# EasyEDA Pro project ProPrj_ch32v305_pico.epro, board 40low_CH32V305_8K
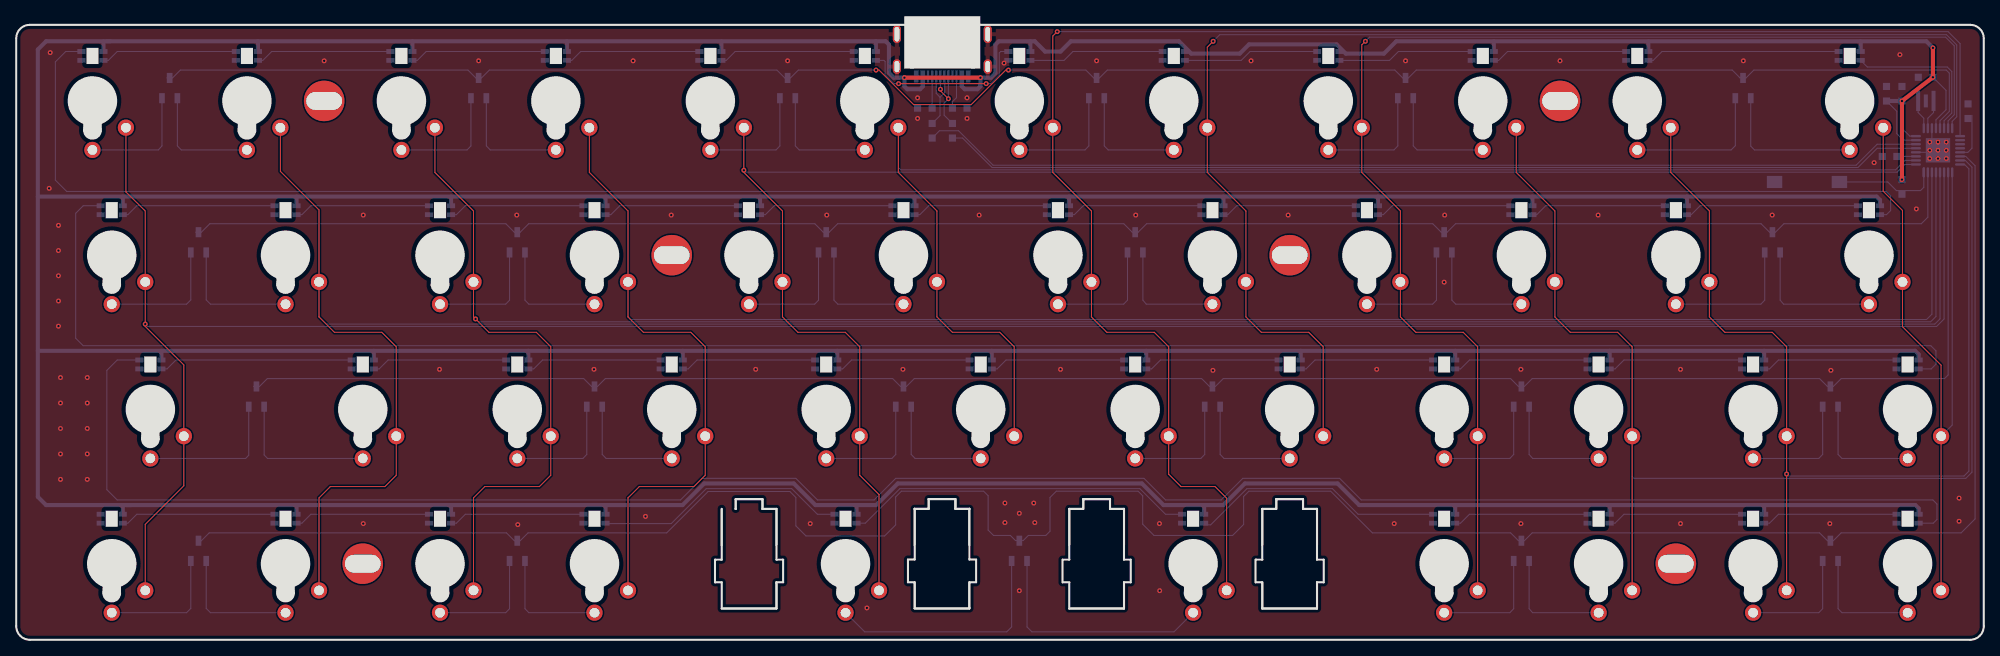
[diagram p9: board, top side]
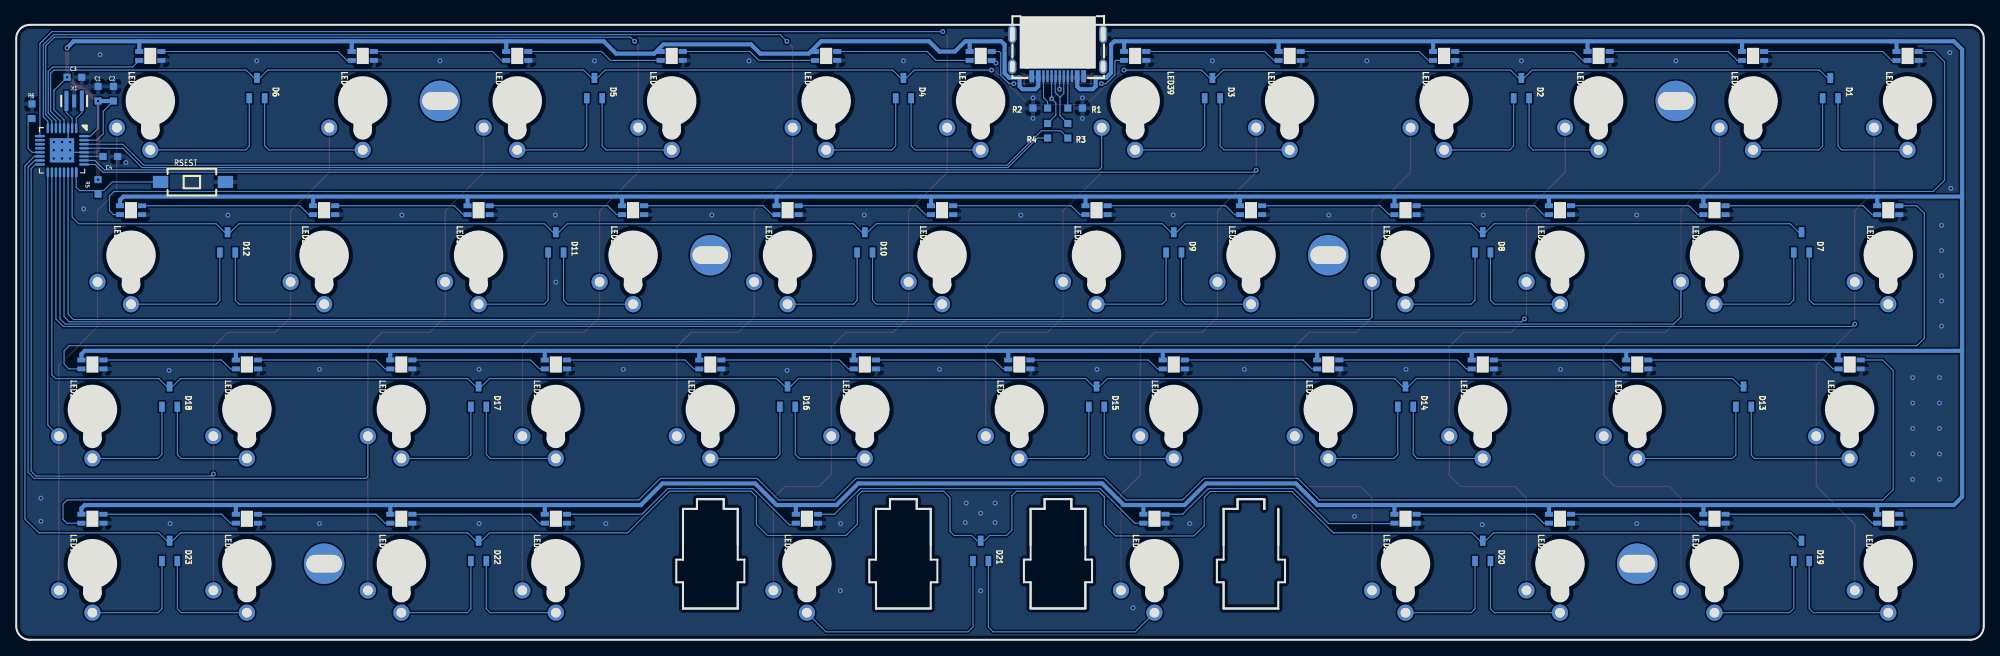
[diagram p10: board, bottom side, seen from below]

Outline 242.63 x 77.01 mm; copper layers: Top Layer, Bottom Layer. Coordinates in mm from the lower left corner of the outline.
Outline path: 86.99,11.7 86.99,16.17 86.99,9.9 86.17,9.9 86.17,7.1 86.99,7.1 86.99,3.87 ; 86.99,3.87 93.74,3.87 ; 86.99,3.87 93.74,3.87 ; 93.74,3.87 93.74,7.1 ; 93.74,3.87 93.74,7.1 ; 88.72,17.37 88.72,16.17 88.72,17.37 ; 88.72,17.37 92.02,17.37 92.02,16.17 93.74,16.17 ; 88.72,17.37 92.02,17.37 92.02,16.17 93.74,16.17 ; 93.74,16.17 93.74,11.7 ; 93.74,16.17 93.74,9.9 94.57,9.9 94.57,7.1 93.74,7.1 ; 110.79,7.11 109.96,7.11 109.96,9.91 110.79,9.91 110.79,16.18 ; 110.79,7.11 110.79,3.88 ; 110.79,7.11 110.79,3.88 ; 110.79,16.18 110.79,11.71 ; 110.79,16.18 112.51,16.18 ; 110.79,16.18 112.52,16.18 ; 110.79,3.88 117.54,3.88 ; 110.79,3.88 117.54,3.88 ; 117.54,3.88 117.54,7.11 ; 117.54,3.88 117.54,7.11 ; 112.51,17.38 112.51,16.18 ; 112.52,17.38 112.52,16.18 ; 112.51,17.38 115.81,17.38 115.81,16.18 117.54,16.18 ; 112.52,17.38 115.81,17.38 115.81,16.18 117.54,16.18 ; 117.54,16.18 117.54,11.71 ; 117.54,16.18 117.54,9.91 118.37,9.91 118.37,7.11 117.54,7.11 ; 129.86,16.17 129.86,11.7 ; 129.86,16.17 129.86,9.9 129.03,9.9 129.03,7.1 129.86,7.1 129.86,3.87 ; 129.86,16.17 131.58,16.17 131.58,17.37 134.88,17.37 134.88,16.17 136.61,16.17 136.61,11.7 ; 129.86,16.17 131.58,16.17 131.58,17.37 134.88,17.37 134.88,16.17 136.61,16.17 136.61,9.9 137.43,9.9 137.43,7.1 136.61,7.1 136.61,3.87 129.86,3.87 ; 129.86,3.87 136.61,3.87 136.61,7.1 ; 153.66,11.7 153.66,16.17 155.38,16.17 155.38,17.37 158.68,17.37 158.68,16.17 160.41,16.17 160.41,9.9 161.23,9.9 161.23,7.1 160.41,7.1 160.41,3.87 153.66,3.87 153.66,7.1 152.83,7.1 152.83,9.9 153.66,9.9 153.66,16.17 155.38,16.17 155.38,17.37 158.68,17.37 158.68,16.17 160.41,16.17 160.41,11.7 ; 153.66,7.1 153.66,3.87 160.41,3.87 160.41,7.1 ; 0,74.27 arc(0.49,75.46) 1.68,75.95 240.95,75.95 arc(242.14,75.46) 242.63,74.27 242.63,1.68 arc(242.14,0.49) 240.95,0 1.68,0 arc(0.49,0.49) 0,1.68 0,74.27
Stack: Top Layer 0.035mm / Bottom Layer 0.035mm

## Design rules (mm)
spacing Default (default): track to track 0.102, other pairs 0 to 0.3
track width Default (default): min 0.127, default 0.127, max 25.4
differential pair differentialPair (default): width min 0.127, default 2.54, max 2.54; gap min 0.127, default 0.152

## Placement (name value [footprint] x y rotation side)
C1  100nf  [0603]  232.54 67.44 90 bottom
C2  100nf  [0603]  230.63 67.44 90 bottom
C3  470nf  [0603]  235.46 69.47 180 bottom
C4  1uf  [0603]  231.01 59.69 0 bottom
D1  MMBD4148  [SOT-23-3]  18.92 68.14 270 bottom
D2  MMBD4148  [SOT-23-3]  57.02 68.14 270 bottom
D3  MMBD4148  [SOT-23-3]  95.12 68.14 270 bottom
D4  MMBD4148  [SOT-23-3]  133.22 68.14 270 bottom
D5  MMBD4148  [SOT-23-3]  171.32 68.14 270 bottom
D6  MMBD4148  [SOT-23-3]  212.94 68.14 270 bottom
D7  MMBD4148  [SOT-23-3]  22.48 49.09 270 bottom
D8  MMBD4148  [SOT-23-3]  61.79 49.09 270 bottom
D9  MMBD4148  [SOT-23-3]  99.89 49.09 270 bottom
D10  MMBD4148  [SOT-23-3]  137.99 49.09 270 bottom
D11  MMBD4148  [SOT-23-3]  176.09 49.09 270 bottom
D12  MMBD4148  [SOT-23-3]  216.57 49.09 270 bottom
D13  MMBD4148  [SOT-23-3]  29.62 30.04 270 bottom
D14  MMBD4148  [SOT-23-3]  71.31 30.04 270 bottom
D15  MMBD4148  [SOT-23-3]  109.41 30.04 270 bottom
D16  MMBD4148  [SOT-23-3]  147.51 30.04 270 bottom
D17  MMBD4148  [SOT-23-3]  185.61 30.04 270 bottom
D18  MMBD4148  [SOT-23-3]  223.71 30.04 270 bottom
D19  MMBD4148  [SOT-23-3]  22.48 10.99 270 bottom
D20  MMBD4148  [SOT-23-3]  61.79 10.99 270 bottom
D21  MMBD4148  [SOT-23-3]  123.7 10.99 270 bottom
D22  MMBD4148  [SOT-23-3]  185.61 10.99 270 bottom
D23  MMBD4148  [SOT-23-3]  223.71 10.99 270 bottom
LED0  WS2812B  [WS2812 0807]  11.78 14.95 0 bottom
LED1  WS2812B  [WS2812 0807]  33.21 14.95 0 bottom
LED2  WS2812B  [WS2812 0807]  52.26 14.95 0 bottom
LED3  WS2812B  [WS2812 0807]  71.31 14.95 0 bottom
LED4  WS2812B  [WS2812 0807]  102.27 14.95 0 bottom
LED5  WS2812B  [WS2812 0807]  145.13 14.95 0 bottom
LED6  WS2812B  [WS2812 0807]  176.09 14.95 0 bottom
LED7  WS2812B  [WS2812 0807]  195.14 14.95 0 bottom
LED8  WS2812B  [WS2812 0807]  214.19 14.95 0 bottom
LED9  WS2812B  [WS2812 0807]  233.24 14.95 0 bottom
LED10  WS2812B  [WS2812 0807]  16.54 34 0 bottom
LED11  WS2812B  [WS2812 0807]  42.74 34 0 bottom
LED12  WS2812B  [WS2812 0807]  61.79 34 0 bottom
LED13  WS2812B  [WS2812 0807]  80.84 34 0 bottom
LED14  WS2812B  [WS2812 0807]  99.89 34 0 bottom
LED15  WS2812B  [WS2812 0807]  118.94 34 0 bottom
LED16  WS2812B  [WS2812 0807]  137.99 34 0 bottom
LED17  WS2812B  [WS2812 0807]  157.04 34 0 bottom
LED18  WS2812B  [WS2812 0807]  176.09 34 0 bottom
LED19  WS2812B  [WS2812 0807]  195.14 34 0 bottom
LED20  WS2812B  [WS2812 0807]  214.19 34 0 bottom
LED21  WS2812B  [WS2812 0807]  233.24 34 0 bottom
LED22  WS2812B  [WS2812 0807]  11.78 53.05 0 bottom
LED23  WS2812B  [WS2812 0807]  33.21 53.05 0 bottom
LED24  WS2812B  [WS2812 0807]  52.26 53.05 0 bottom
LED25  WS2812B  [WS2812 0807]  71.31 53.05 0 bottom
LED26  WS2812B  [WS2812 0807]  90.36 53.05 0 bottom
LED27  WS2812B  [WS2812 0807]  109.41 53.05 0 bottom
LED28  WS2812B  [WS2812 0807]  128.46 53.05 0 bottom
LED29  WS2812B  [WS2812 0807]  147.51 53.05 0 bottom
LED30  WS2812B  [WS2812 0807]  166.56 53.05 0 bottom
LED31  WS2812B  [WS2812 0807]  185.61 53.05 0 bottom
LED32  WS2812B  [WS2812 0807]  204.66 53.05 0 bottom
LED33  WS2812B  [WS2812 0807]  228.47 53.05 0 bottom
LED34  WS2812B  [WS2812 0807]  9.4 72.1 0 bottom
LED35  WS2812B  [WS2812 0807]  28.45 72.1 0 bottom
LED36  WS2812B  [WS2812 0807]  47.5 72.1 0 bottom
LED37  WS2812B  [WS2812 0807]  66.55 72.1 0 bottom
LED38  WS2812B  [WS2812 0807]  85.6 72.1 0 bottom
LED39  WS2812B  [WS2812 0807]  104.65 72.1 0 bottom
LED40  WS2812B  [WS2812 0807]  123.7 72.1 0 bottom
LED41  WS2812B  [WS2812 0807]  142.75 72.1 0 bottom
LED42  WS2812B  [WS2812 0807]  161.8 72.1 0 bottom
LED43  WS2812B  [WS2812 0807]  180.85 72.1 0 bottom
LED44  WS2812B  [WS2812 0807]  199.9 72.1 0 bottom
LED45  WS2812B  [WS2812 0807]  226.09 72.1 0 bottom
NOREF  -  [Pad_e676]  235.23 57.73 180 top
NOREF#2  -  [Pad_e1541]  157.04 47.5 0 top
NOREF#3  -  [Pad_e1542]  190.37 66.55 0 top
NOREF#4  -  [Pad_e1539]  204.66 9.4 0 top
NOREF#5  -  [Pad_e1540]  37.97 66.55 0 top
NOREF#6  -  [Pad_e1537]  42.74 9.4 0 top
NOREF#7  -  [Pad_e1538]  80.84 47.5 0 top
R1  5.1k  [0603]  112.05 65.66 0 bottom
R2  5.1k  [0603]  116.35 65.66 180 bottom
R3  22  [0603]  112.95 62.87 270 bottom
R4  22  [0603]  115.45 62.87 270 bottom
R5  10k  [0603]  232.54 55.93 90 bottom
R6  10k  [0603]  240.69 65.28 90 bottom
RSEST  TS-1101-C-W  [SW-SMD_L6.0-W3.3-LS8.0]  220.83 56.54 180 bottom
S1  MX COPY  [CHERRY-MX-LOW-PROFILE COPY]  9.4 66.55 0 top
S2  MX COPY  [CHERRY-MX-LOW-PROFILE COPY]  28.45 66.55 0 top
S3  MX COPY  [CHERRY-MX-LOW-PROFILE COPY]  47.5 66.55 0 top
S4  MX COPY  [CHERRY-MX-LOW-PROFILE COPY]  66.55 66.55 0 top
S5  MX COPY  [CHERRY-MX-LOW-PROFILE COPY]  85.6 66.55 0 top
S6  MX COPY  [CHERRY-MX-LOW-PROFILE COPY]  104.65 66.55 0 top
S7  MX COPY  [CHERRY-MX-LOW-PROFILE COPY]  123.7 66.55 0 top
S8  MX COPY  [CHERRY-MX-LOW-PROFILE COPY]  142.75 66.55 0 top
S9  MX COPY  [CHERRY-MX-LOW-PROFILE COPY]  161.8 66.55 0 top
S10  MX COPY  [CHERRY-MX-LOW-PROFILE COPY]  180.85 66.55 0 top
S11  MX COPY  [CHERRY-MX-LOW-PROFILE COPY]  199.9 66.55 0 top
S12  MX COPY  [CHERRY-MX-LOW-PROFILE COPY]  226.09 66.55 0 top
S13  MX COPY  [CHERRY-MX-LOW-PROFILE COPY]  11.78 47.5 0 top
S14  MX COPY  [CHERRY-MX-LOW-PROFILE COPY]  33.21 47.5 0 top
S15  MX COPY  [CHERRY-MX-LOW-PROFILE COPY]  52.26 47.5 0 top
S16  MX COPY  [CHERRY-MX-LOW-PROFILE COPY]  71.31 47.5 0 top
S17  MX COPY  [CHERRY-MX-LOW-PROFILE COPY]  90.36 47.5 0 top
S18  MX COPY  [CHERRY-MX-LOW-PROFILE COPY]  109.41 47.5 0 top
S19  MX COPY  [CHERRY-MX-LOW-PROFILE COPY]  128.46 47.5 0 top
S20  MX COPY  [CHERRY-MX-LOW-PROFILE COPY]  147.51 47.5 0 top
S21  MX COPY  [CHERRY-MX-LOW-PROFILE COPY]  166.56 47.5 0 top
S22  MX COPY  [CHERRY-MX-LOW-PROFILE COPY]  185.61 47.5 0 top
S23  MX COPY  [CHERRY-MX-LOW-PROFILE COPY]  204.66 47.5 0 top
S24  MX COPY  [CHERRY-MX-LOW-PROFILE COPY]  228.47 47.5 0 top
S25  MX COPY  [CHERRY-MX-LOW-PROFILE COPY]  16.54 28.45 0 top
S26  MX COPY  [CHERRY-MX-LOW-PROFILE COPY]  42.74 28.45 0 top
S27  MX COPY  [CHERRY-MX-LOW-PROFILE COPY]  61.79 28.45 0 top
S28  MX COPY  [CHERRY-MX-LOW-PROFILE COPY]  80.84 28.45 0 top
S29  MX COPY  [CHERRY-MX-LOW-PROFILE COPY]  99.89 28.45 0 top
S30  MX COPY  [CHERRY-MX-LOW-PROFILE COPY]  118.94 28.45 0 top
S31  MX COPY  [CHERRY-MX-LOW-PROFILE COPY]  137.99 28.45 0 top
S32  MX COPY  [CHERRY-MX-LOW-PROFILE COPY]  157.04 28.45 0 top
S33  MX COPY  [CHERRY-MX-LOW-PROFILE COPY]  176.09 28.45 0 top
S34  MX COPY  [CHERRY-MX-LOW-PROFILE COPY]  195.14 28.45 0 top
S35  MX COPY  [CHERRY-MX-LOW-PROFILE COPY]  214.19 28.45 0 top
S36  MX COPY  [CHERRY-MX-LOW-PROFILE COPY]  233.24 28.45 0 top
S37  MX COPY  [CHERRY-MX-LOW-PROFILE COPY]  11.78 9.4 0 top
S38  MX COPY  [CHERRY-MX-LOW-PROFILE COPY]  33.21 9.4 0 top
S39  MX COPY  [CHERRY-MX-LOW-PROFILE COPY]  52.26 9.4 0 top
S40  MX COPY  [CHERRY-MX-LOW-PROFILE COPY]  71.31 9.4 0 top
S41  MX COPY  [CHERRY-MX-LOW-PROFILE COPY]  102.27 9.4 0 top
S42  MX COPY  [CHERRY-MX-LOW-PROFILE COPY]  145.13 9.4 0 top
S43  MX COPY  [CHERRY-MX-LOW-PROFILE COPY]  176.09 9.4 0 top
S44  MX COPY  [CHERRY-MX-LOW-PROFILE COPY]  195.14 9.4 0 top
S45  MX COPY  [CHERRY-MX-LOW-PROFILE COPY]  214.19 9.4 0 top
S46  MX COPY  [CHERRY-MX-LOW-PROFILE COPY]  233.24 9.4 0 top
U2  ATMEGA32U2-MU  [32U2-MU]  236.98 60.45 0 bottom
USB1  TYPE-C 16P CB1.6  [USB-C-SMD_TYPE-C-16P-CB1.6]  114.2 72.19 0 bottom
X1  16MHz  [OSC-SMD_3P-L3.2-W1.3-P0.95-L]  235.48 66.55 0 bottom

## Footprints (pads in the part's own frame, mm; a bottom-side part is the same pattern mirrored in y, then rotated)
32U2-MU
  oval 0.3x1.25 smd: 1(-1.75,-2.725) 2(-1.252,-2.725) 3(-0.751,-2.725) 4(-0.252,-2.725) 5(0.248,-2.725) 6(0.749,-2.725) 7(1.248,-2.725) 8(1.748,-2.725) 17(1.752,2.725) 18(1.252,2.725) 19(0.751,2.725) 20(0.252,2.725) 21(-0.248,2.725) 22(-0.749,2.725) 23(-1.248,2.725) 24(-1.748,2.725)
  oval 1.25x0.3 smd: 9(2.725,-1.748) 10(2.725,-1.248) 11(2.725,-0.748) 12(2.725,-0.248) 13(2.725,0.252) 14(2.725,0.752) 15(2.725,1.252) 16(2.725,1.752) 25(-2.725,1.75) 26(-2.725,1.25) 27(-2.725,0.75) 28(-2.725,0.25) 29(-2.725,-0.25) 30(-2.725,-0.75) 31(-2.725,-1.25) 32(-2.725,-1.75)
  rect 3x3 smd: 33(0,0)
0603
  rect 0.88x0.88 smd: 1(-0.9,0) 2(0.9,0)
CHERRY-MX-LOW-PROFILE COPY
  round 2 hole 1.205x1.2: 1(4.13,-3.3) 2(0,-6.05)
OSC-SMD_3P-L3.2-W1.3-P0.95-L
  rect 0.5x2.5 smd: 1(-0.95,0) 3(0.95,0)
  rect 0.5x1.6 smd: 2(0,0)
Pad_e676
  oval 0.3x1.25 smd far side: 2(0,0)
Pad_e1537
  round 5 hole 4.4x2.2: 1(0,0)
Pad_e1538
  round 5 hole 4.4x2.2: 1(0,0)
Pad_e1539
  round 5 hole 4.4x2.2: 1(0,0)
Pad_e1540
  round 5 hole 4.4x2.2: 1(0,0)
Pad_e1541
  round 5 hole 4.4x2.2: 1(0,0)
Pad_e1542
  round 5 hole 4.4x2.2: 1(0,0)
SOT-23-3
  rect 1.25x0.7 smd: 1(1.25,-0.95) 2(1.25,0.95) 3(-1.25,0)
SW-SMD_L6.0-W3.3-LS8.0
  rect 1.9x1.5 smd: 1(-4,0) 2(4,0)
USB-C-SMD_TYPE-C-16P-CB1.6
  oval 1x1.8 hole 0.6x1.4: 13(5.6,1.4) 16(-5.6,1.4)
  oval 1x2.2 hole 0.6x1.8: 14(5.6,-2.6) 15(-5.6,-2.6)
  rect 0.6x1.5 smd: A1B12(-3.2,2.6) A4B9(-2.4,2.6) B1A12(3.2,2.6) B4A9(2.4,2.6)
  rect 0.3x1.5 smd: A5(-1.25,2.6) A6(-0.25,2.6) A7(0.25,2.6) A8(1.25,2.6) B5(1.75,2.6) B6(0.75,2.6) B7(-0.75,2.6) B8(-1.75,2.6)
WS2812 0807
  rect 1x0.6 smd: 1(1.36,-0.55) 2(-1.36,-0.55) 3(-1.36,0.55) 4(1.36,0.55)

## Nets
As in the schematic, except:
GND: C1.2 C2.2 C3.2 C4.1 LED0.3 LED1.3 LED2.3 LED3.3 LED4.3 LED5.3 LED6.3 LED7.3 LED8.3 LED9.3 LED10.3 LED11.3 LED12.3 LED13.3 LED14.3 LED15.3 LED16.3 LED17.3 LED18.3 LED19.3 LED20.3 LED21.3 LED22.3 LED23.3 LED24.3 LED25.3 LED26.3 LED27.3 LED28.3 LED29.3 LED30.3 LED31.3 LED32.3 LED33.3 LED34.3 LED35.3 LED36.3 LED37.3 LED38.3 LED39.3 LED40.3 LED41.3 LED42.3 LED43.3 LED44.3 LED45.3 R1.1 R2.1 R6.2 RSEST.2 U2.3 U2.28 U2.33 USB1.13 USB1.14 USB1.15 USB1.16 USB1.A1B12 USB1.B1A12 X1.2
U2_24: NOREF.2 R5.1 RSEST.1 U2.24

Pads without a net: LED0 2; NOREF#2 1; NOREF#3 1; NOREF#4 1; NOREF#5 1; NOREF#6 1; NOREF#7 1; U2 10 11 12; USB1 A8 B8

## Via types
v1: diameter 0.61, hole 0.305, Top Layer to Bottom Layer, 102 vias

## Routing (per net, layer and track width the routed paths; a pad name or vN(x,y) marks a point on that pad's centre or on a via; arc(x,y) is an arc through that point)
GND: length 5.9
  Bottom Layer w0.127: U2.3 236.23,61.2 v1(236.98,60.45) 236.73,60.2 234.26,60.2
  vias: v1(4.06,55.75) v1(4.19,72.52) v1(5.21,51.18) v1(5.21,48.07) v1(5.21,44.96) v1(5.21,41.85) v1(5.21,38.74) v1(5.46,32.39) v1(5.46,29.24) v1(5.46,26.1) v1(5.46,22.96) v1(5.46,19.81) v1(8.76,32.39) v1(8.76,29.24) v1(8.76,26.1) v1(8.76,22.96) v1(8.76,19.81) v1(37.97,71.5) v1(42.8,52.45) v1(42.8,14.35) v1(52.2,33.4) v1(57.02,71.5) v1(61.72,52.45) v1(61.85,14.22) v1(71.25,33.4) v1(76.07,71.5) v1(77.6,15.24) v1(80.77,52.45) v1(91.19,33.4) v1(95.12,71.5) v1(97.92,14.35) v1(99.95,52.45) v1(104.9,3.94) v1(109.35,33.4) v1(111.15,66.93) v1(111.15,64.39) v1(117.25,66.93) v1(117.25,64.39) v1(118.75,52.45) v1(121.82,71.22) v1(121.92,16.89) v1(121.92,14.48) v1(123.7,15.62) v1(123.7,6.06) v1(125.48,16.89) v1(125.6,14.48) v1(128.78,33.4) v1(133.22,71.5) v1(138.05,52.45) v1(140.97,14.35) v1(141,6.06) v1(147.57,33.27) v1(152.27,71.5) v1(156.84,52.45) v1(167.77,33.4) v1(169.93,14.35) v1(171.32,71.5) v1(176.15,52.45) v1(176.09,44.16) v1(185.55,33.4) v1(185.55,14.35) v1(190.37,71.5) v1(195.07,52.45) v1(205.23,33.4) v1(205.23,14.35) v1(212.98,71.5) v1(216.53,52.45) v1(223.65,14.35) v1(223.77,33.27) v1(229.11,58.93) v1(232.28,72.26) v1(234.32,53.21) v1(235.97,61.47) v1(235.97,60.45) v1(235.97,59.44) v1(236.98,61.47) v1(236.98,59.44) v1(238,61.47) v1(238,60.45) v1(238,59.44) v1(239.59,17.49) v1(239.59,14.64)
VCC: length 1099.7
  Top Layer w0.508: v1(118.9,69.42) v1(109.53,69.42) ; v1(232.54,56.83) v1(232.54,66.54) v1(236.36,69.47) v1(236.36,73.1)
  Bottom Layer w0.127: 230.63,66.54 231.9,65.27 231.9,62.51 232.71,61.7 234.26,61.7 ; U2.4 236.73,64.21 237.97,65.46 237.97,67.85 v1(236.36,69.47) ; v1(232.54,66.54) 232.54,63.17 233.51,62.2 234.26,62.2
  Bottom Layer w0.508: LED14.1 101.25,35.69 ; 2.67,54.74 229.41,54.74 229.83,54.32 229.83,53.6 ; LED45.1 227.45,73.91 ; LED5.1 146.49,16.64 ; C2.1 C1.1 ; LED13.1 82.2,35.69 ; 116.6,69.29 116.6,68.36 116.97,68 118.54,68 118.9,68.35 v1(118.9,69.42) 120.19,69.42 120.75,69.98 120.75,73.51 121.16,73.91 125.6,73.91 126.87,72.64 128.78,72.64 130.05,73.91 143.38,73.91 144.91,72.39 150.88,72.39 152.02,73.53 162.81,73.53 163.96,72.39 168.66,72.39 170.18,73.91 235.54,73.91 v1(236.36,73.1) ; LED4.1 103.63,16.64 ; 11.18,73.91 107.21,73.91 107.62,73.51 107.62,70 108.2,69.42 v1(109.53,69.42) 109.53,68.35 109.88,68 111.46,68 111.8,68.34 111.8,69.29 ; LED8.1 215.55,16.64 ; LED26.1 91.72,54.74 ; 14.2,16.64 3.68,16.64 2.67,17.65 2.67,72.9 3.68,73.91 11.58,73.91 ; LED0.1 13.14,16.64 ; LED9.1 234.59,16.23 234.19,16.64 165.61,16.64 162.94,19.3 151.51,19.3 148.84,16.64 141.48,16.64 138.81,19.3 108.71,19.3 106.04,16.64 98.55,16.64 95.89,19.3 84.84,19.3 82.17,16.64 13.59,16.64 ; LED12.1 63.15,35.69 ; LED24.1 53.62,54.74 ; LED40.1 125.06,73.91 ; LED22.1 13.14,54.74 ; LED31.1 186.97,54.74 ; LED6.1 177.45,16.64 ; LED38.1 86.96,73.91 ; LED10.1 17.9,35.69 ; LED16.1 139.35,35.69 ; LED3.1 72.67,16.64 ; LED18.1 177.45,35.69 ; 34.57,53.6 34.57,54.74 ; LED21.1 234.59,35.26 234.16,35.69 2.67,35.69 ; LED20.1 215.55,35.69 ; 34.57,15.5 34.57,16.64 ; LED30.1 167.92,54.74 ; LED27.1 110.77,54.74 ; LED25.1 72.67,54.74 ; LED34.1 10.76,73.91 ; LED2.1 53.62,16.64 ; LED37.1 67.91,73.91 ; LED28.1 129.82,54.74 ; LED35.1 29.81,73.91 ; LED43.1 182.21,73.91 ; LED36.1 48.86,73.91 ; LED29.1 148.87,54.74 ; LED15.1 120.3,35.69 ; LED19.1 196.5,35.69 ; LED44.1 201.26,73.91 ; LED11.1 44.1,35.69 ; LED17.1 158.4,35.69 ; LED39.1 106.01,73.91 ; LED7.1 196.5,16.64 ; 206.02,53.6 206.02,54.74
C4_2: length 2.3
  Bottom Layer w0.127: 234.26,59.7 231.91,59.7
COL1: length 302.5
  Top Layer w0.127: 15.91,6.1 15.91,14.26 20.67,19.02 S25.1 20.67,33.94 15.91,38.7 v1(15.91,38.99) S13.1 15.91,52.96 13.53,55.31 S1.1
  Bottom Layer w0.127: 15.91,38.99 16.2,38.7 236.81,38.7 237.73,39.62 U2.19
COL2: length 297.3
  Top Layer w0.127: S38.1 37.34,17.53 38.73,18.92 45.47,18.92 46.87,20.32 S26.1 46.87,36.19 45.08,37.97 39.24,37.97 37.34,39.88 S14.1 37.34,53.08 32.58,57.85 S2.1
  Bottom Layer w0.127: U2.20 237.23,39.64 236.59,38.99 38.24,38.99 37.34,39.88 S14.1
COL3: length 272.7
  Top Layer w0.127: S3.1 51.63,57.72 56.39,52.96 56.39,39.88 58.29,37.97 64.14,37.97 65.92,36.19 S27.1 65.92,20.32 64.52,18.92 57.78,18.92 56.39,17.53 56.39,6.1
  Bottom Layer w0.127: v1(56.64,39.62) 56.77,39.5 57.01,39.27 236.07,39.27 236.73,39.93 U2.21
COL4: length 257.4
  Top Layer w0.127: S40.1 75.44,17.53 76.83,18.92 83.57,18.92 84.97,20.32 S28.1 84.97,36.19 83.19,37.97 77.34,37.97 75.44,39.88 S16.1 75.44,52.96 70.68,57.72 S4.1
  Bottom Layer w0.127: S16.1 75.44,39.88 75.76,39.55 235.57,39.55 236.23,40.22 U2.22
COL5: length 212.5
  Top Layer w0.127: S5.1 89.73,57.72 94.49,52.96 S17.1 94.49,39.88 96.39,37.97 102.23,37.97 104.02,36.19 S29.1 104.02,20.32 106.4,17.94 106.4,6.1
  Bottom Layer w0.127: 234.26,58.7 232.9,58.7 231.94,57.75 89.97,57.75 v1(89.73,57.99)
COL6: length 178.4
  Top Layer w0.127: S6.1 108.78,57.72 113.54,52.96 S18.1 113.54,39.88 115.44,37.97 121.28,37.97 123.07,36.19 S30.1
  Bottom Layer w0.127: S6.1 108.78,58.35 109.09,58.04 231.75,58.04 232.91,59.2 234.26,59.2
COL7: length 207.5
  Top Layer w0.127: v1(128.37,75.11) 127.83,74.56 127.83,63.14 ; S7.1 127.83,57.72 132.59,52.96 S19.1 132.59,39.88 134.49,37.97 140.34,37.97 142.12,36.19 S31.1 142.12,20.44 143.64,18.92 147.83,18.92 149.26,17.49 S42.1
  Bottom Layer w0.127: v1(128.37,75.11) 238.23,75.11 239.71,73.63 239.71,62.2
COL8: length 161.5
  Top Layer w0.127: v1(147.6,73.91) 146.88,73.19 S8.1 146.88,57.72 151.64,52.96 S20.1 151.64,39.88 153.54,37.97 159.38,37.97 161.17,36.19 S32.1
  Bottom Layer w0.127: v1(147.6,73.91) 148.41,74.73 238.02,74.73 239.29,73.46 239.29,64.59 238.73,64.03 238.73,63.18
COL9: length 161.1
  Top Layer w0.127: v1(166.37,73.91) 165.93,73.47 S9.1 165.93,57.72 170.69,52.96 S21.1 170.69,39.88 172.59,37.97 178.44,37.97 180.22,36.19 S33.1 S43.1
  Bottom Layer w0.127: v1(166.37,73.91) 166.88,74.42 237.92,74.42 238.99,73.36 238.99,64.85 238.23,64.09 U2.7
COL10: length 153.3
  Top Layer w0.127: S10.1 184.98,57.72 189.74,52.96 S22.1 189.74,39.88 191.64,37.97 197.48,37.97 199.27,36.19 S34.1 S44.1
  Bottom Layer w0.127: S34.1 199.27,20.17 199.49,19.94 240.41,19.94 241.17,20.7 241.17,58.37 240.34,59.2 239.71,59.2
COL11: length 128
  Top Layer w0.127: S11.1 204.03,57.72 208.79,52.96 S23.1 208.79,39.88 210.69,37.97 216.53,37.97 218.32,36.19 S35.1 S45.1
  Bottom Layer w0.127: 239.71,58.7 240.26,58.7 240.79,58.17 240.79,20.83 240.19,20.22 218.56,20.22 v1(218.31,20.47)
COL12: length 93.4
  Top Layer w0.127: S12.1 230.22,55.4 232.6,53.02 S24.1 232.6,38.67 237.37,33.91 S36.1 ; 237.37,25.32 S46.1
  Bottom Layer w0.127: 238.73,57.73 238.73,26.52 S36.1
D+: length 11.3
  Top Layer w0.127: v1(113.97,68) 113.97,67.79 v1(114.95,66.81)
  Bottom Layer w0.127: R4.1 114.43,64.79 114.43,66.29 v1(114.95,66.81) 114.95,70.26 ; USB1.A6 v1(113.97,68) ; 113.95,69.29 113.95,70.26
D-: length 8.7
  Bottom Layer w0.127: 113.92,67.01 113.92,64.73 R3.1 ; 113.92,67.01 114.5,67.59 114.5,69.24 114.45,69.3 ; 113.92,67.01 113.45,67.48 113.45,69.29 ; 113.45,69.29 arc(113.45,69.29) 113.45,69.3 ; 114.45,69.29 arc(114.45,69.29) 114.45,69.3
LED1_2: length 19.2
  Bottom Layer w0.127: LED0.4 13.77,14.4 14.87,15.5 LED1.2
LED1_4: length 16.8
  Bottom Layer w0.127: LED1.4 35.23,14.4 36.33,15.5 50.9,15.5
LED2_4: length 16.8
  Bottom Layer w0.127: LED2.4 54.28,14.4 55.38,15.5 LED3.2
LED3_4: length 31.3
  Bottom Layer w0.127: 72.67,14.35 80.77,14.35 85.09,18.67 95.63,18.67 98.8,15.5 LED4.2
LED4_4: length 43.2
  Bottom Layer w0.127: LED4.4 104.7,14.4 108.97,18.67 138.56,18.67 141.72,15.5 LED5.2
LED5_4: length 31.4
  Bottom Layer w0.127: 174.73,15.5 165.47,15.5 162.31,18.67 151.76,18.67 147.29,14.2 146.48,14.2
LED6_4: length 16.8
  Bottom Layer w0.127: LED7.2 179.21,15.5 178.1,14.4 177.44,14.4
LED7_4: length 16.8
  Bottom Layer w0.127: 212.83,15.5 198.26,15.5 197.16,14.4 LED7.4
LED8_4: length 16.8
  Bottom Layer w0.127: LED9.2 217.31,15.5 216.21,14.4 215.54,14.4
LED9_4: length 256.7
  Bottom Layer w0.127: LED10.2 12.46,34.55 11.18,33.27 11.18,18.54 12.45,17.27 81.92,17.27 84.58,19.94 96.14,19.94 98.81,17.27 105.79,17.27 108.46,19.94 139.06,19.94 141.73,17.27 148.59,17.27 151.26,19.94 163.19,19.94 165.86,17.27 236.35,17.27 236.85,16.76 236.85,14.86 236.4,14.4 LED9.4
LED10_4: length 23.9
  Bottom Layer w0.127: LED11.2 19.7,34.55 18.6,33.45 LED10.4
LED11_4: length 16.8
  Bottom Layer w0.127: LED11.4 44.75,33.45 45.86,34.55 60.43,34.55
LED12_4: length 16.8
  Bottom Layer w0.127: 63.14,33.45 63.81,33.45 64.91,34.55 LED13.2
LED13_4: length 16.8
  Bottom Layer w0.127: LED13.4 82.86,33.45 83.96,34.55 98.53,34.55
LED14_4: length 16.8
  Bottom Layer w0.127: 101.24,33.45 101.91,33.45 103.01,34.55 LED15.2
LED15_4: length 16.8
  Bottom Layer w0.127: 136.63,34.55 122.06,34.55 120.96,33.45 LED15.4
LED16_4: length 16.8
  Bottom Layer w0.127: LED17.2 141.11,34.55 140.01,33.45 139.34,33.45
LED17_4: length 16.8
  Bottom Layer w0.127: 174.73,34.55 160.16,34.55 159.06,33.45 LED17.4
LED18_4: length 16.8
  Bottom Layer w0.127: 177.44,33.45 178.11,33.45 179.21,34.55 LED19.2
LED19_4: length 16.8
  Bottom Layer w0.127: 212.83,34.55 198.26,34.55 197.16,33.45 LED19.4
LED20_4: length 16.8
  Bottom Layer w0.127: LED21.2 217.31,34.55 216.21,33.45 215.54,33.45
LED21_4: length 253
  Bottom Layer w0.127: LED22.2 8.27,53.6 7.34,52.67 7.34,37.24 8.26,36.32 236.09,36.32 236.73,35.69 236.73,34.04 236.15,33.45 LED21.4
LED22_4: length 19.2
  Bottom Layer w0.127: LED22.4 13.77,52.5 14.87,53.6 LED23.2
LED23_4: length 16.8
  Bottom Layer w0.127: 50.9,53.6 36.34,53.6 35.23,52.5 LED23.4
LED24_4: length 16.8
  Bottom Layer w0.127: LED25.2 55.38,53.6 54.28,52.5 LED24.4
LED25_4: length 16.8
  Bottom Layer w0.127: 89,53.6 74.43,53.6 73.33,52.5 72.67,52.5
LED26_4: length 16.8
  Bottom Layer w0.127: LED26.4 92.38,52.5 93.48,53.6 LED27.2
LED27_4: length 16.8
  Bottom Layer w0.127: 110.77,52.5 111.43,52.5 112.53,53.6 127.1,53.6
LED28_4: length 16.8
  Bottom Layer w0.127: LED29.2 131.59,53.6 130.48,52.5 LED28.4
LED29_4: length 16.8
  Bottom Layer w0.127: 165.2,53.6 150.51,53.6 149.41,52.5 148.87,52.5
LED30_4: length 16.8
  Bottom Layer w0.127: LED30.4 168.58,52.5 169.69,53.6 LED31.2
LED31_4: length 16.8
  Bottom Layer w0.127: 186.97,52.5 187.51,52.5 188.61,53.6 203.3,53.6
LED32_4: length 21.5
  Bottom Layer w0.127: LED33.2 207.66,53.6 206.55,52.5 206.02,52.5
LED33_4: length 248.8
  Bottom Layer w0.127: 8.04,72.65 6.11,72.65 4.83,71.37 4.83,56.77 6.22,55.37 230.58,55.37 231.14,54.81 231.14,53.01 230.63,52.5 229.83,52.5
LED34_4: length 16.8
  Bottom Layer w0.127: 27.09,72.65 12.46,72.65 11.36,71.55 LED34.4
LED35_4: length 16.8
  Bottom Layer w0.127: LED35.4 30.41,71.55 31.51,72.65 46.14,72.65
LED36_4: length 16.8
  Bottom Layer w0.127: LED36.4 49.46,71.55 50.56,72.65 65.19,72.65
LED37_4: length 16.8
  Bottom Layer w0.127: 84.24,72.65 69.61,72.65 68.51,71.55 LED37.4
LED38_4: length 16.8
  Bottom Layer w0.127: LED38.4 87.56,71.55 88.66,72.65 103.29,72.65
LED39_4: length 21.7
  Top Layer w0.127: v1(108.81,68.68) v1(119.61,68.68)
  Bottom Layer w0.127: LED40.2 121.4,72.65 121.22,72.48 121.22,69.74 120.17,68.68 v1(119.61,68.68) ; LED39.4 107.01,71.55 107.15,71.41 107.15,69.79 108.25,68.68 v1(108.81,68.68)
LED40_4: length 16.8
  Bottom Layer w0.127: 141.39,72.65 130.31,72.65 129.21,71.55 LED40.4
LED41_4: length 16.8
  Bottom Layer w0.127: LED41.4 151.05,71.55 152.16,72.65 160.44,72.65
LED42_4: length 16.8
  Bottom Layer w0.127: LED42.4 169.34,71.55 170.44,72.65 179.49,72.65
LED43_4: length 16.8
  Bottom Layer w0.127: LED43.4 182.8,71.55 183.91,72.65 198.54,72.65
LED44_4: length 23.9
  Bottom Layer w0.127: LED45.2 202.96,72.65 201.86,71.55 LED44.4
R1_2: length 3.6
  Bottom Layer w0.127: 112.95,69.29 112.95,65.66
R2_2: length 3.8
  Bottom Layer w0.127: R2.2 115.45,66.45 115.95,66.95 115.95,69.29
R3_2: length 124.5
  Bottom Layer w0.127: 112.95,61.97 113.85,62.87 116.21,62.87 120.46,58.61 226.88,58.61 229.48,61.2 234.26,61.2
R4_2: length 121.3
  Bottom Layer w0.127: 234.26,60.7 229.48,60.7 227.11,58.32 120.34,58.32 116.7,61.97 115.45,61.97
R6_1: length 5.7
  Bottom Layer w0.127: 241.17,64.77 241.17,60.71 240.67,60.2 U2.13
RGB: length 19.2
  Bottom Layer w0.127: LED45.4 228.27,70.74 238.12,70.74 238.68,70.18 238.68,65.05 237.73,64.1 U2.6
ROW1: length 235.2
  Top Layer w0.127: v1(106.03,70.36) 106.4,70.36 110.67,66.09 117.75,66.09 122.02,70.36 v1(122.35,70.36)
  Bottom Layer w0.127: U2.5 237.23,64.11 238.38,65.25 238.38,69.98 238,70.36 214.27,70.36 213.31,69.39 212.57,69.39 211.61,70.36 172.64,70.36 171.68,69.39 170.97,69.39 170,70.36 134.54,70.36 133.58,69.39 132.87,69.39 131.9,70.36 v1(122.35,70.36) ; v1(106.03,70.36) 96.44,70.36 95.48,69.39 94.77,69.39 93.8,70.36 58.34,70.36 57.38,69.39 56.67,69.39 55.7,70.36 20.24,70.36 19.28,69.39 18.57,69.39
ROW2: length 224.2
  Bottom Layer w0.127: U2.23 235.73,52.19 234.92,51.38 217.98,51.38 216.94,50.34 216.21,50.34 215.16,51.38 177.5,51.38 176.45,50.34 175.72,50.34 174.68,51.38 139.4,51.38 138.35,50.34 137.62,50.34 136.58,51.38 101.3,51.38 100.25,50.34 99.52,50.34 98.48,51.38 63.2,51.38 62.15,50.34 61.42,50.34 60.38,51.38 23.88,51.38 22.83,50.34 22.12,50.34
ROW3: length 238.6
  Bottom Layer w0.127: 238.23,57.73 238.23,32.71 237.78,32.26 225.04,32.26 224.08,31.29 223.34,31.29 222.38,32.26 186.94,32.26 185.98,31.29 185.24,31.29 184.28,32.26 148.84,32.26 147.88,31.29 147.14,31.29 146.18,32.26 110.74,32.26 109.78,31.29 109.04,31.29 108.08,32.26 72.64,32.26 71.68,31.29 70.94,31.29 69.98,32.26 30.96,32.26 30,31.29 29.26,31.29
ROW4: length 300
  Bottom Layer w0.127: U2.14 240.4,59.7 241.55,58.55 241.55,14.93 239.83,13.21 225.04,13.21 224.08,12.24 223.34,12.24 222.38,13.21 186.94,13.21 185.98,12.24 185.24,12.24 184.28,13.21 167.23,13.21 162.09,18.35 152.01,18.35 151.36,17.7 151.36,14.25 150,12.89 140.3,12.89 138.91,14.28 138.91,17.78 138.34,18.35 128.26,18.35 127.48,17.58 127.48,13.41 126.96,12.89 124.81,12.89 124.18,12.26 123.22,12.26 122.59,12.89 120.51,12.89 119.85,13.55 119.85,17.79 119.29,18.35 109.16,18.35 108.45,17.64 108.45,14.19 107.09,12.83 97.39,12.83 96.14,14.07 96.14,17.58 95.4,18.31 85.32,18.31 80.21,13.21 63.12,13.21 62.15,12.24 61.42,12.24 60.45,13.21 23.8,13.21 22.83,12.24 D19.3
S1_2: length 14.7
  Bottom Layer w0.127: D1.2 17.97,61 17.53,60.5 S1.2
S2_2: length 14.7
  Bottom Layer w0.127: S2.2 20.35,60.5 19.87,61 D1.1
S3_2: length 14.7
  Bottom Layer w0.127: D2.2 56.07,61 55.6,60.5 S3.2
S4_2: length 14.7
  Bottom Layer w0.127: D2.1 57.97,61 58.45,60.5 S4.2
S5_2: length 14.7
  Bottom Layer w0.127: D3.2 94.17,61 93.7,60.5 S5.2
S6_2: length 14.7
  Bottom Layer w0.127: S6.2 96.55,60.5 96.07,61 D3.1
S7_2: length 14.7
  Bottom Layer w0.127: D4.2 132.27,61 131.8,60.5 S7.2
S8_2: length 14.7
  Bottom Layer w0.127: S8.2 134.65,60.5 134.17,61 D4.1
S9_2: length 14.7
  Bottom Layer w0.127: S9.2 169.9,60.5 170.37,61 D5.2
S10_2: length 14.7
  Bottom Layer w0.127: S10.2 172.75,60.5 172.27,61 D5.1
S11_2: length 18.2
  Bottom Layer w0.127: S11.2 211.47,60.5 211.99,61.02 D6.2
S12_2: length 18.3
  Bottom Layer w0.127: 226.09,60.5 214.35,60.5 213.89,60.97 D6.1
S13_2: length 15.8
  Bottom Layer w0.127: 21.53,47.84 21.53,41.98 21,41.45 11.78,41.45
S14_2: length 15.9
  Bottom Layer w0.127: 33.21,41.45 23.96,41.45 23.43,41.98 23.43,47.84
S15_2: length 14.7
  Bottom Layer w0.127: 52.26,41.45 60.36,41.45 60.84,41.95 60.84,47.84
S16_2: length 14.7
  Bottom Layer w0.127: 71.31,41.45 63.22,41.45 62.74,41.95 62.74,47.84
S17_2: length 14.7
  Bottom Layer w0.127: 90.36,41.45 98.46,41.45 98.94,41.95 98.94,47.84
S18_2: length 14.7
  Bottom Layer w0.127: 100.84,47.84 100.84,41.95 101.32,41.45 109.41,41.45
S19_2: length 14.7
  Bottom Layer w0.127: 137.04,47.84 137.04,41.95 136.56,41.45 128.46,41.45
S20_2: length 14.7
  Bottom Layer w0.127: 138.94,47.84 138.94,41.95 139.35,41.45 147.51,41.45
S21_2: length 14.7
  Bottom Layer w0.127: 175.14,47.84 175.14,41.95 174.66,41.45 166.56,41.45
S22_2: length 14.7
  Bottom Layer w0.127: 185.61,41.45 177.52,41.45 177.04,41.95 177.04,47.84
S23_2: length 17.1
  Bottom Layer w0.127: 215.62,47.84 215.62,41.95 215.14,41.45 204.66,41.45
S24_2: length 17.1
  Bottom Layer w0.127: 228.47,41.45 217.94,41.45 217.52,41.95 217.52,47.84
S25_2: length 18.3
  Bottom Layer w0.127: 16.54,22.4 28.29,22.4 28.67,22.8 28.67,28.79
S26_2: length 18.3
  Bottom Layer w0.127: D13.1 30.57,22.83 30.99,22.4 S26.2
S27_2: length 14.7
  Bottom Layer w0.127: S27.2 69.88,22.4 70.36,22.9 D14.2
S28_2: length 14.7
  Bottom Layer w0.127: S28.2 72.74,22.4 72.26,22.9 72.26,28.79
S29_2: length 14.7
  Bottom Layer w0.127: 108.46,28.79 108.46,22.9 107.98,22.4 S29.2
S30_2: length 14.7
  Bottom Layer w0.127: S30.2 110.84,22.4 110.36,22.9 D15.1
S31_2: length 14.7
  Bottom Layer w0.127: S31.2 146.08,22.4 146.56,22.9 146.56,28.79
S32_2: length 14.7
  Bottom Layer w0.127: S32.2 148.94,22.4 148.46,22.9 D16.1
S33_2: length 14.7
  Bottom Layer w0.127: D17.2 184.66,22.9 184.18,22.4 S33.2
S34_2: length 14.7
  Bottom Layer w0.127: D17.1 186.56,22.9 187,22.4 S34.2
S35_2: length 14.7
  Bottom Layer w0.127: S35.2 222.28,22.4 222.76,22.9 D18.2
S36_2: length 14.7
  Bottom Layer w0.127: S36.2 225.14,22.4 224.66,22.9 D18.1
S37_2: length 15.8
  Bottom Layer w0.127: 21.53,9.74 21.53,3.88 21,3.35 11.78,3.35
S38_2: length 15.9
  Bottom Layer w0.127: 33.21,3.35 23.96,3.35 23.43,3.88 23.43,9.74
S39_2: length 14.7
  Bottom Layer w0.127: 60.84,9.74 60.84,3.85 60.36,3.35 52.26,3.35
S40_2: length 14.7
  Bottom Layer w0.127: 71.31,3.35 63.22,3.35 62.74,3.85 62.74,9.74
S41_2: length 29.9
  Bottom Layer w0.127: 102.27,3.35 104.63,0.98 122.14,0.98 122.75,1.59 122.75,9.74
S42_2: length 29.9
  Bottom Layer w0.127: 124.65,9.74 124.65,1.59 125.25,0.98 142.77,0.98 145.13,3.35
S43_2: length 14.7
  Bottom Layer w0.127: 176.09,3.35 184.18,3.35 184.66,3.85 184.66,9.74
S44_2: length 14.7
  Bottom Layer w0.127: 186.56,9.74 186.56,3.85 186.99,3.35 195.14,3.35
S45_2: length 14.7
  Bottom Layer w0.127: 222.76,9.74 222.76,3.85 222.28,3.35 214.19,3.35
S46_2: length 14.7
  Bottom Layer w0.127: 224.66,9.74 224.66,3.85 225.14,3.35 233.24,3.35
U2_1: length 3.7
  Bottom Layer w0.127: X1.1 234.53,65.11 235.23,64.41 U2.1
U2_2: length 3.7
  Bottom Layer w0.127: X1.3 236.43,65.11 235.73,64.41 U2.2
U2_24: length 12.9
  Bottom Layer w0.127: 235.23,57.73 235.23,55.89 234.82,55.47 231.85,55.47 230.78,56.54 RSEST.1

## Copper pours and planes (outline as drawn; the poured copper is in the pictures)
GND on Top Layer: 244.47,78.11 244.47,-2.41 -3.43,-2.41 -3.43,78.11
GND on Bottom Layer: -1.65,77.6 -1.65,-1.4 243.71,-1.4 243.71,77.09
